# EAGLE design 8Bit Register_Right (EAGLE 9.6.1)
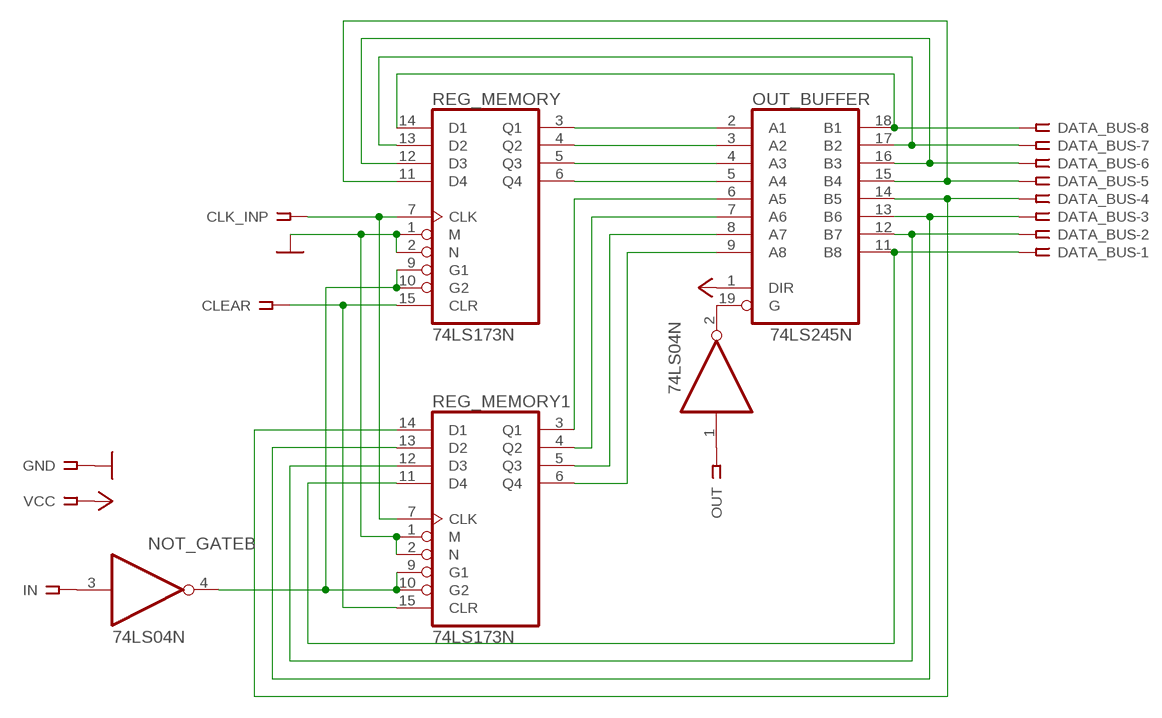
[diagram p0: schematic, sheet 1]

## Parts
CLEAR  SSW-101-02-G-S-RA  [SSW-101-02-G-S-RA]
CLK_INP  SSW-101-02-G-S-RA  [SSW-101-02-G-S-RA]
DATA_BUS  SSW-108-02-G-S  [SSW-108-02-G-S]
GND  SSW-101-02-G-S-RA  [SSW-101-02-G-S-RA]
IN  SSW-101-02-G-S-RA  [SSW-101-02-G-S-RA]
NOT_GATE  74LS04N  [DIL14]
OUT  SSW-101-02-G-S-RA  [SSW-101-02-G-S-RA]
OUT_BUFFER  74LS245N  [DIL20]
REG_MEMORY  74LS173N  [DIL16]
REG_MEMORY1  74LS173N  [DIL16]
VCC  SSW-101-02-G-S-RA  [SSW-101-02-G-S-RA]

## Nets
GND: GND.1 REG_MEMORY1.1(M) REG_MEMORY1.2(N) REG_MEMORY.1(M) REG_MEMORY.2(N)
N$1: CLK_INP.1 REG_MEMORY1.7(CLK) REG_MEMORY.7(CLK)
N$2: NOT_GATE.1(A:I) OUT.1
N$3: CLEAR.1 REG_MEMORY1.15(CLR) REG_MEMORY.15(CLR)
N$4: OUT_BUFFER.2(A1) REG_MEMORY.3(Q1)
N$5: OUT_BUFFER.3(A2) REG_MEMORY.4(Q2)
N$6: OUT_BUFFER.4(A3) REG_MEMORY.5(Q3)
N$7: OUT_BUFFER.5(A4) REG_MEMORY.6(Q4)
N$8: OUT_BUFFER.6(A5) REG_MEMORY1.3(Q1)
N$9: OUT_BUFFER.7(A6) REG_MEMORY1.4(Q2)
N$10: OUT_BUFFER.8(A7) REG_MEMORY1.5(Q3)
N$11: OUT_BUFFER.9(A8) REG_MEMORY1.6(Q4)
N$12: NOT_GATE.2(A:O) OUT_BUFFER.19(G)
N$13: DATA_BUS.8 OUT_BUFFER.18(B1) REG_MEMORY.14(D1)
N$14: DATA_BUS.7 OUT_BUFFER.17(B2) REG_MEMORY.13(D2)
N$15: NOT_GATE.4(B:O) REG_MEMORY1.9(G1) REG_MEMORY1.10(G2) REG_MEMORY.9(G1) REG_MEMORY.10(G2)
N$16: DATA_BUS.6 OUT_BUFFER.16(B3) REG_MEMORY.12(D3)
N$17: DATA_BUS.5 OUT_BUFFER.15(B4) REG_MEMORY.11(D4)
N$18: DATA_BUS.1 OUT_BUFFER.11(B8) REG_MEMORY1.11(D4)
N$19: DATA_BUS.2 OUT_BUFFER.12(B7) REG_MEMORY1.12(D3)
N$20: DATA_BUS.3 OUT_BUFFER.13(B6) REG_MEMORY1.13(D2)
N$21: DATA_BUS.4 OUT_BUFFER.14(B5) REG_MEMORY1.14(D1)
N$22: IN.1 NOT_GATE.3(B:I)
VCC: OUT_BUFFER.1(DIR) VCC.1
Unconnected: NOT_GATE.5(C:I) NOT_GATE.6(C:O) NOT_GATE.8(D:O) NOT_GATE.9(D:I) NOT_GATE.10(E:O) NOT_GATE.11(E:I) NOT_GATE.12(F:O) NOT_GATE.13(F:I)

## Power pins joined to a net without a drawn wire
GND: NOT_GATE.7(P:GND) OUT_BUFFER.10(GND) REG_MEMORY1.8(GND) REG_MEMORY.8(GND)
VCC: NOT_GATE.14(P:VCC) OUT_BUFFER.20(VCC) REG_MEMORY1.16(VCC) REG_MEMORY.16(VCC)

## Library data of the parts
CLEAR CLK_INP GND IN OUT VCC = con-samtec:SSW-101-02-G-S: THROUGH-HOLE .025" SQ POST SOCKET Source: Samtec SSW.pdf; MF: Samtec Inc.; MPN: SSW-101-02-G-S-RA; OC_FARNELL: unknown; OC_NEWARK: 11P9337
DATA_BUS = con-samtec:SSW-108-02-G-S: THROUGH-HOLE .025" SQ POST SOCKET Source: Samtec SSW.pdf; MF: Samtec Inc.; MPN: SSW-108-02-G-S; OC_FARNELL: unknown; OC_NEWARK: 11P9448
NOT_GATE = 74xx-eu:74*04: Hex INVERTER
OUT_BUFFER = 74xx-eu:74*245: Octal BUS TRANSCEIVER, 3-state
REG_MEMORY REG_MEMORY1 = 74xx-eu:74*173: 4-bit D type REGISTER, 3-state

## Board
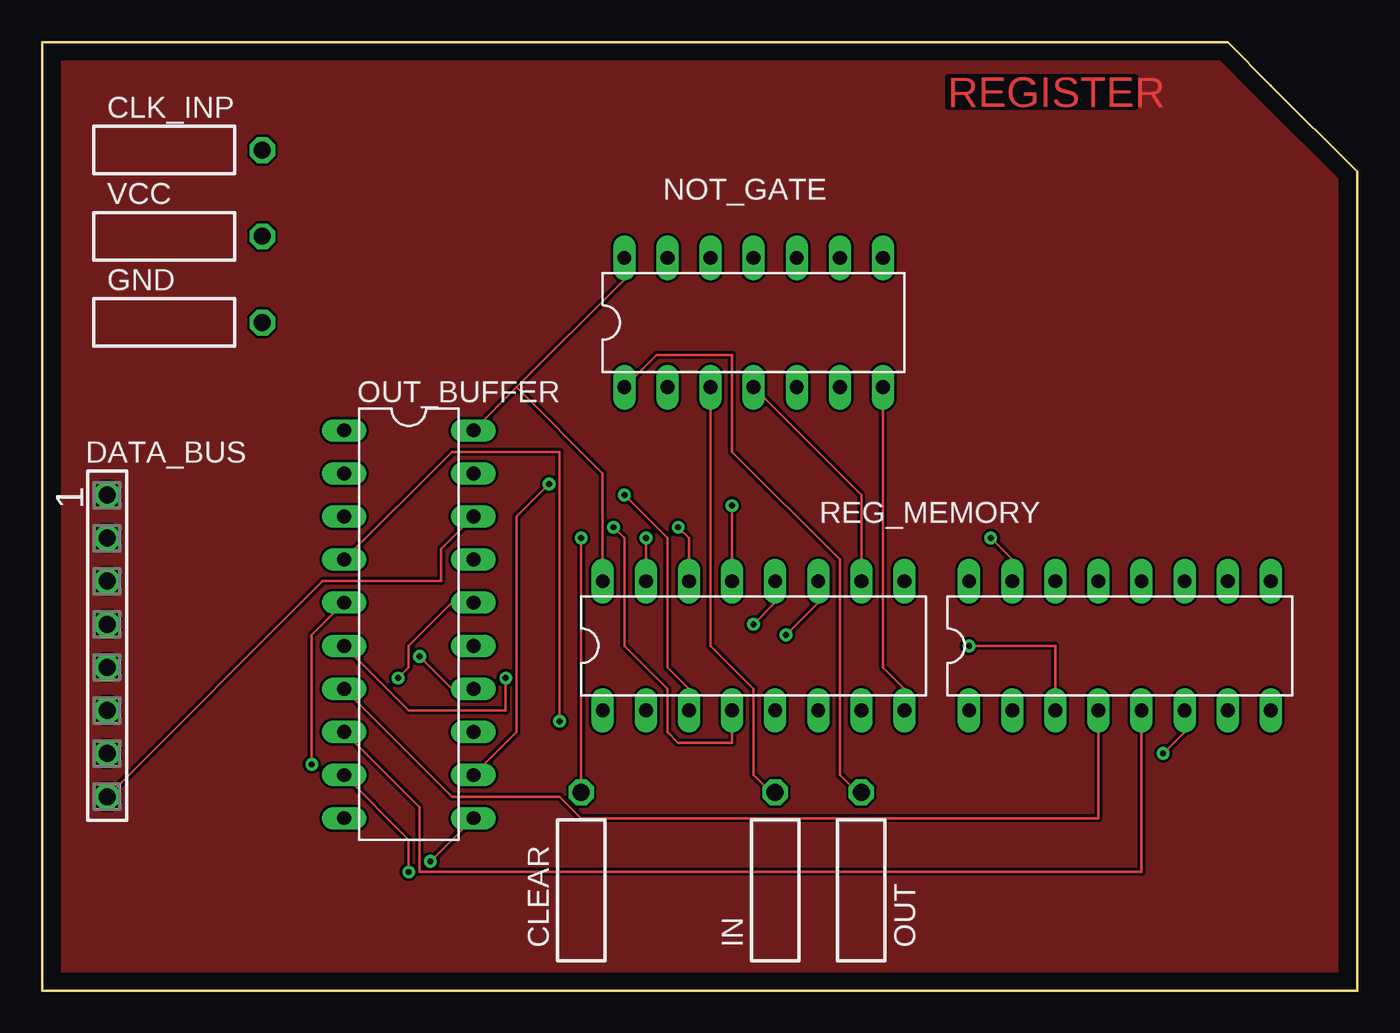
[diagram p1: board, top side]
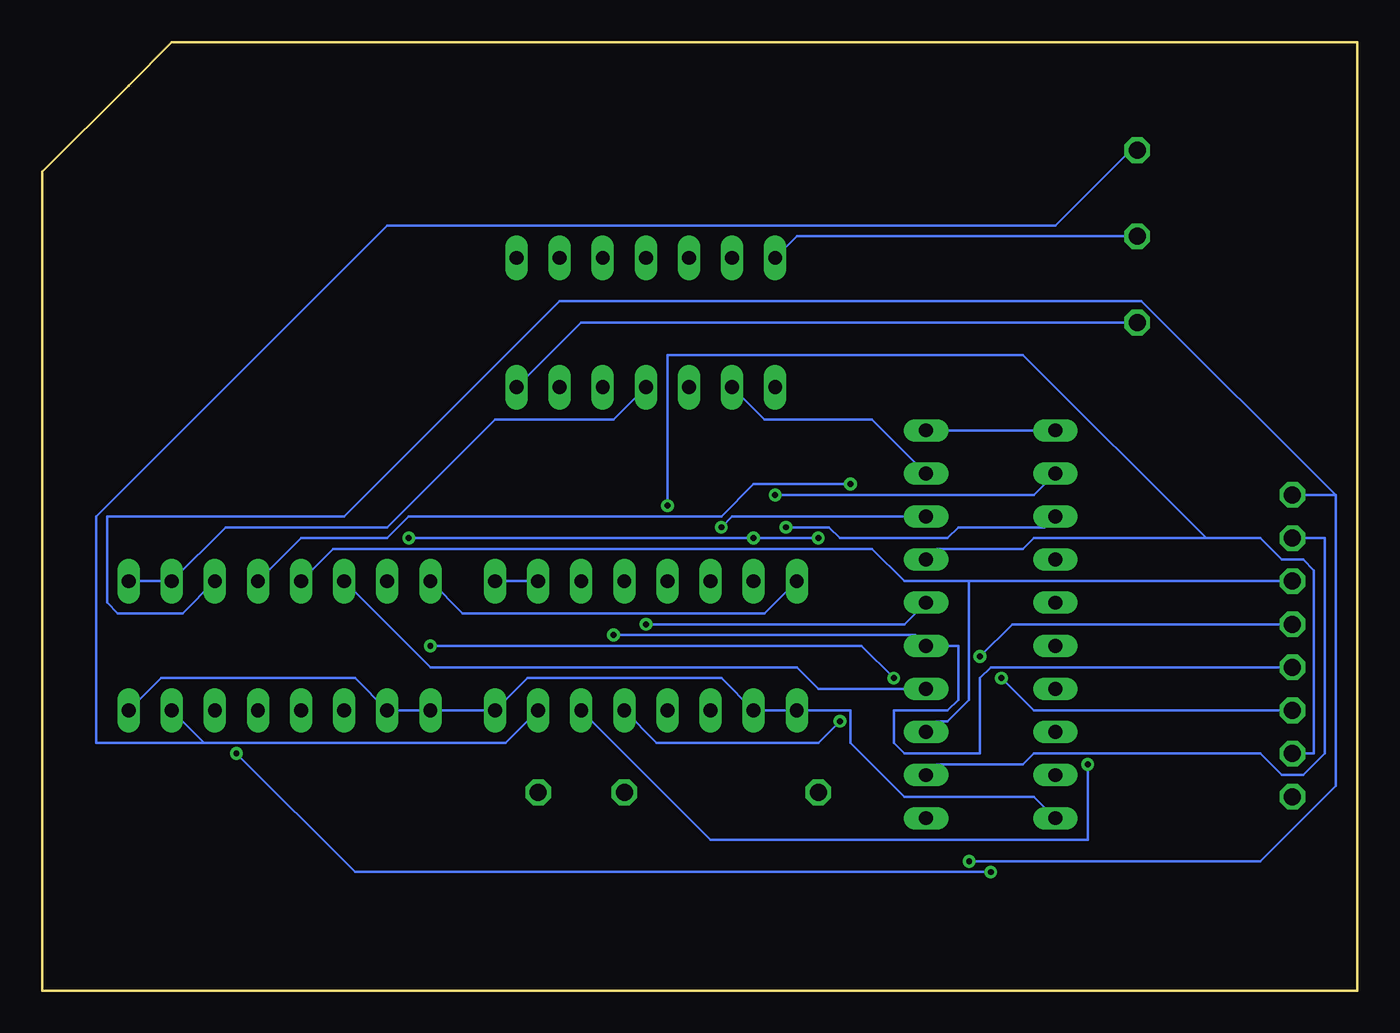
[diagram p2: board, bottom side, seen from below]

Size 77.47 x 55.88 mm. Coordinates in mm from the lower left corner, seen from the top.
Outline: 0,55.88 0,0 77.47,0 77.47,48.26 72.39,53.34 69.85,55.88 0,55.88
Copper layers (1*16): Top 0.035mm / dielectric 1.5mm / Bottom 0.035mm
Design rules "default": minimum track width 6mil, minimum drill 0.35mm, track to track 6mil, track to pad 6mil, pad to pad 6mil, via to via 6mil, smd to smd 6mil, copper to edge 40mil, drill to drill 6mil, minimum pad ring 10mil, minimum via ring 8mil, stop-mask expansion 4mil, vias tented up to drill 0mil, thermal gap 10mil

### Footprints (pad centres in the part's own frame; a part is rotated, then mirrored left to right if it is on the bottom)
SSW-101-02-G-S-RA = drill 1 pad 1.5 octagon: 1 0,1.524
SSW-108-02-G-S = drill 1 pad 1.5 octagon: 1 -8.89,0; 2 -6.35,0; 3 -3.81,0; 4 -1.27,0; 5 1.27,0; 6 3.81,0; 7 6.35,0; 8 8.89,0
DIL14 = drill 0.813 long: 1 -7.62,-3.81; 2 -5.08,-3.81; 3 -2.54,-3.81; 4 0,-3.81; 5 2.54,-3.81; 6 5.08,-3.81; 7 7.62,-3.81; 8 7.62,3.81; 9 5.08,3.81; 10 2.54,3.81; 11 0,3.81; 12 -2.54,3.81; 13 -5.08,3.81; 14 -7.62,3.81
DIL20 = drill 0.813 long: 1 -11.43,-3.81; 2 -8.89,-3.81; 3 -6.35,-3.81; 4 -3.81,-3.81; 5 -1.27,-3.81; 6 1.27,-3.81; 7 3.81,-3.81; 8 6.35,-3.81; 9 8.89,-3.81; 10 11.43,-3.81; 11 11.43,3.81; 12 8.89,3.81; 13 6.35,3.81; 14 3.81,3.81; 15 1.27,3.81; 16 -1.27,3.81; 17 -3.81,3.81; 18 -6.35,3.81; 19 -8.89,3.81; 20 -11.43,3.81
DIL16 = drill 0.813 long: 1 -8.89,-3.81; 2 -6.35,-3.81; 3 -3.81,-3.81; 4 -1.27,-3.81; 5 1.27,-3.81; 6 3.81,-3.81; 7 6.35,-3.81; 8 8.89,-3.81; 9 8.89,3.81; 10 6.35,3.81; 11 3.81,3.81; 12 1.27,3.81; 13 -1.27,3.81; 14 -3.81,3.81; 15 -6.35,3.81; 16 -8.89,3.81

### Placement (x,y rotation side)
CLEAR  31.75,10.16 0 top
CLK_INP  11.43,49.53 270 top
DATA_BUS  3.81,20.32 270 top
GND  11.43,39.37 270 top
IN  43.18,10.16 0 top
NOT_GATE  41.91,39.37 0 top
OUT  48.26,10.16 0 top
OUT_BUFFER  21.59,21.59 270 top
REG_MEMORY  41.91,20.32 0 top
REG_MEMORY1  63.5,20.32 0 top
VCC  11.43,44.45 270 top

### Tracks (layer width: path | path; a pad name or v marks a point on that pad's centre or on a via)
GND
  Top 0.152: NOT_GATE.7 49.53,19.05 50.8,17.78 REG_MEMORY.8
  Bottom 0.152: NOT_GATE.7 45.72,39.37 GND.1 | REG_MEMORY1.8 70.48,18.41 59.05,18.41 REG_MEMORY1.2 REG_MEMORY1.1 REG_MEMORY.8 48.9,18.41 37.47,18.41 REG_MEMORY.2 REG_MEMORY.1 29.84,16.51 29.84,14.61 26.67,11.43 19.05,11.43 OUT_BUFFER.10
MAIN
  pour Top: 0,55.88 69.85,55.88 77.47,48.26 77.47,0 0,0
N$1
  Bottom 0.152: REG_MEMORY.7 50.16,14.61 67.94,14.61 | REG_MEMORY1.7 67.94,14.61 | 67.94,14.61 74.3,14.61 74.3,27.94 57.15,45.08 17.78,45.08 13.34,49.53 CLK_INP.1
N$2
  Top 0.152: NOT_GATE.1 36.2,37.46 40.64,37.46 40.64,31.75 46.99,25.4 46.99,12.7 48.26,11.43 OUT.1
N$3  (via drill 0.35)
  Top 0.152: v35.56,26.67 REG_MEMORY.15 | v55.88,26.67 57.15,25.4 REG_MEMORY1.15 | v31.75,26.67 CLEAR.1
  Bottom 0.152: v55.88,26.67 v35.56,26.67 v31.75,26.67
N$4  (via drill 0.35)
  Top 0.152: v34.29,29.21 36.83,26.67 36.83,19.05 38.1,17.78 REG_MEMORY.3
  Bottom 0.152: OUT_BUFFER.2 19.05,29.21 v34.29,29.21
N$5  (via drill 0.35)
  Top 0.152: v33.66,27.3 34.29,26.67 34.29,20.32 36.83,17.78 36.83,15.24 37.47,14.61 40.64,14.61 REG_MEMORY.4
  Bottom 0.152: OUT_BUFFER.3 18.41,27.3 23.5,27.3 24.13,26.67 30.48,26.67 31.11,27.3 v33.66,27.3
N$6  (via drill 0.35)
  Top 0.152: OUT_BUFFER.4 24.13,31.75 30.48,31.75 v30.48,15.88
  Bottom 0.152: v30.48,15.88 31.75,14.61 41.27,14.61 REG_MEMORY.5
N$7  (via drill 0.35)
  Top 0.152: OUT_BUFFER.5 15.88,20.96 v15.88,13.34
  Bottom 0.152: v15.88,13.34 15.88,8.89 38.1,8.89 REG_MEMORY.6
N$8  (via drill 0.35)
  Top 0.152: OUT_BUFFER.6 21.59,16.51 27.3,16.51 v27.3,18.41 | v54.61,20.32 59.69,20.32 REG_MEMORY1.3
  Bottom 0.152: v27.3,18.41 29.21,20.32 v54.61,20.32
N$9
  Top 0.152: OUT_BUFFER.7 24.13,11.43 30.48,11.43 31.75,10.16 62.23,10.16 REG_MEMORY1.4
N$10
  Top 0.152: OUT_BUFFER.8 22.23,10.79 22.23,6.99 64.77,6.99 REG_MEMORY1.5
N$11  (via drill 0.35)
  Top 0.152: OUT_BUFFER.9 21.59,8.89 v21.59,6.99 | v66.04,13.97 67.31,15.24 REG_MEMORY1.6
  Bottom 0.152: v21.59,6.99 59.05,6.99 v66.04,13.97
N$12
  Bottom 0.152: OUT_BUFFER.19 28.57,33.65 34.92,33.65 NOT_GATE.2
N$13  (via drill 0.35)
  Top 0.152: v37.47,27.3 38.1,26.67 REG_MEMORY.14 | DATA_BUS.8 16.51,24.13 23.5,24.13 23.5,26.04 OUT_BUFFER.18
  Bottom 0.152: OUT_BUFFER.18 36.83,27.94 v37.47,27.3
N$14  (via drill 0.35)
  Top 0.152: v40.64,28.57 REG_MEMORY.13
  Bottom 0.152: OUT_BUFFER.17 24.77,26.04 19.68,26.04 19.05,26.67 8.89,26.67 | 8.89,26.67 5.71,26.67 4.45,25.4 3.17,25.4 2.54,24.77 2.54,13.97 DATA_BUS.7 | v40.64,28.57 40.64,37.46 19.68,37.46 8.89,26.67
N$15
  Top 0.152: NOT_GATE.4 48.26,29.21 REG_MEMORY.10
  Bottom 0.152: REG_MEMORY1.9 REG_MEMORY1.10 66.67,27.3 57.15,27.3 50.8,33.65 43.81,33.65 NOT_GATE.4 | REG_MEMORY.10 REG_MEMORY.9
N$16  (via drill 0.35)
  Top 0.152: v41.91,21.59 43.18,22.86 REG_MEMORY.12 | v20.95,18.41 21.59,19.05 21.59,20.32 24.13,22.86 OUT_BUFFER.16
  Bottom 0.152: OUT_BUFFER.16 26.67,21.59 v41.91,21.59 | DATA_BUS.6 19.05,16.51 v20.95,18.41
N$17  (via drill 0.35)
  Top 0.152: v43.81,20.96 45.72,22.86 REG_MEMORY.11
  Bottom 0.152: v43.81,20.96 26.04,20.96 OUT_BUFFER.15 23.5,20.32 23.5,17.14 24.13,16.51 27.3,16.51 27.3,14.61 26.67,13.97 22.23,13.97 22.23,18.41 21.59,19.05 DATA_BUS.5
N$18  (via drill 0.35)
  Top 0.152: v22.86,7.62 OUT_BUFFER.11
  Bottom 0.152: v22.86,7.62 5.71,7.62 1.27,12.07 1.27,29.21 | DATA_BUS.1 1.27,29.21 | REG_MEMORY1.11 69.22,22.23 73.03,22.23 73.66,22.86 73.66,27.94 59.69,27.94 46.99,40.64 12.7,40.64 1.27,29.21
N$19  (via drill 0.35)
  Top 0.152: v29.84,29.84 27.94,27.94 27.94,15.24 OUT_BUFFER.12
  Bottom 0.152: OUT_BUFFER.12 24.77,13.34 19.68,13.34 19.05,13.97 5.71,13.97 4.45,12.7 3.17,12.7 1.91,13.97 1.91,26.67 DATA_BUS.2 | REG_MEMORY1.12 62.23,26.67 57.15,26.67 55.88,27.94 37.47,27.94 35.56,29.84 v29.84,29.84
N$20
  Bottom 0.152: OUT_BUFFER.13 24.77,15.88 24.13,15.88 22.86,17.14 22.86,24.13 | DATA_BUS.3 22.86,24.13 | REG_MEMORY1.13 60.33,26.04 28.57,26.04 26.67,24.13 22.86,24.13
N$21  (via drill 0.35)
  Top 0.152: v22.23,19.68 24.13,17.78 OUT_BUFFER.14
  Bottom 0.152: OUT_BUFFER.14 31.75,17.78 33.02,19.05 54.61,19.05 REG_MEMORY1.14 | DATA_BUS.4 20.32,21.59 v22.23,19.68
N$22
  Top 0.152: NOT_GATE.3 39.37,20.32 41.91,17.78 41.91,12.7 43.18,11.43 IN.1
VCC
  Top 0.152: 27.94,35.56 34.29,41.91 NOT_GATE.14 | 27.94,35.56 OUT_BUFFER.20 | REG_MEMORY.16 33.02,30.48 27.94,35.56
  Bottom 0.152: REG_MEMORY.16 34.92,22.23 52.7,22.23 REG_MEMORY1.16 | OUT_BUFFER.20 OUT_BUFFER.1 | NOT_GATE.14 33.02,44.45 VCC.1

### Text on the board
Top: REGISTER